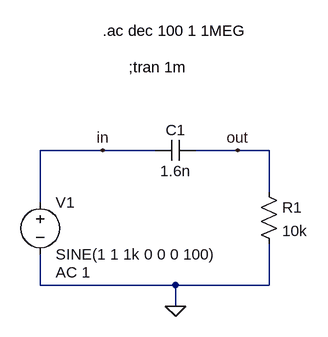
[diagram p0: schematic Priklad2.asc]
Priklad2.asc, the LTspice schematic file:
Version 4
SHEET 1 880 680
WIRE -112 -16 -208 -16
WIRE -32 -16 -112 -16
WIRE 96 -16 32 -16
WIRE 144 -16 96 -16
WIRE 144 48 144 -16
WIRE -208 64 -208 -16
WIRE -208 192 -208 144
WIRE 0 192 -208 192
WIRE 144 192 144 128
WIRE 144 192 0 192
WIRE 0 224 0 192
FLAG 0 224 0
FLAG -112 -16 in
FLAG 96 -16 out
SYMBOL voltage -208 48 R0
WINDOW 123 24 124 Left 2
WINDOW 39 0 0 Left 2
SYMATTR InstName V1
SYMATTR Value SINE(1 1 1k 0 0 0 100)
SYMATTR Value2 AC 1
SYMBOL res 128 32 R0
SYMATTR InstName R1
SYMATTR Value 10k
SYMBOL cap -32 0 R270
WINDOW 0 32 32 VTop 2
WINDOW 3 0 32 VBottom 2
SYMATTR InstName C1
SYMATTR Value 1.6n
TEXT -112 -200 Left 2 !.ac dec 100 1 1MEG
TEXT -72 -144 Left 2 !;tran 1m

The netlist it stands for:
* Priklad2.asc
V1 in 0 SINE(1 1 1k 0 0 0 100) AC 1
R1 out 0 10k
C1 in out 1.6n
.ac dec 100 1 1MEG
;tran 1m
.backanno
.end